# EasyEDA schematic LEDA_Arcade Controller Touch sensor.json
TITLE: SliderPiece; REV: 1.0; Date: 2019-05-25; Sheet: 1/1; Drawn By: nobody; Company: Personal
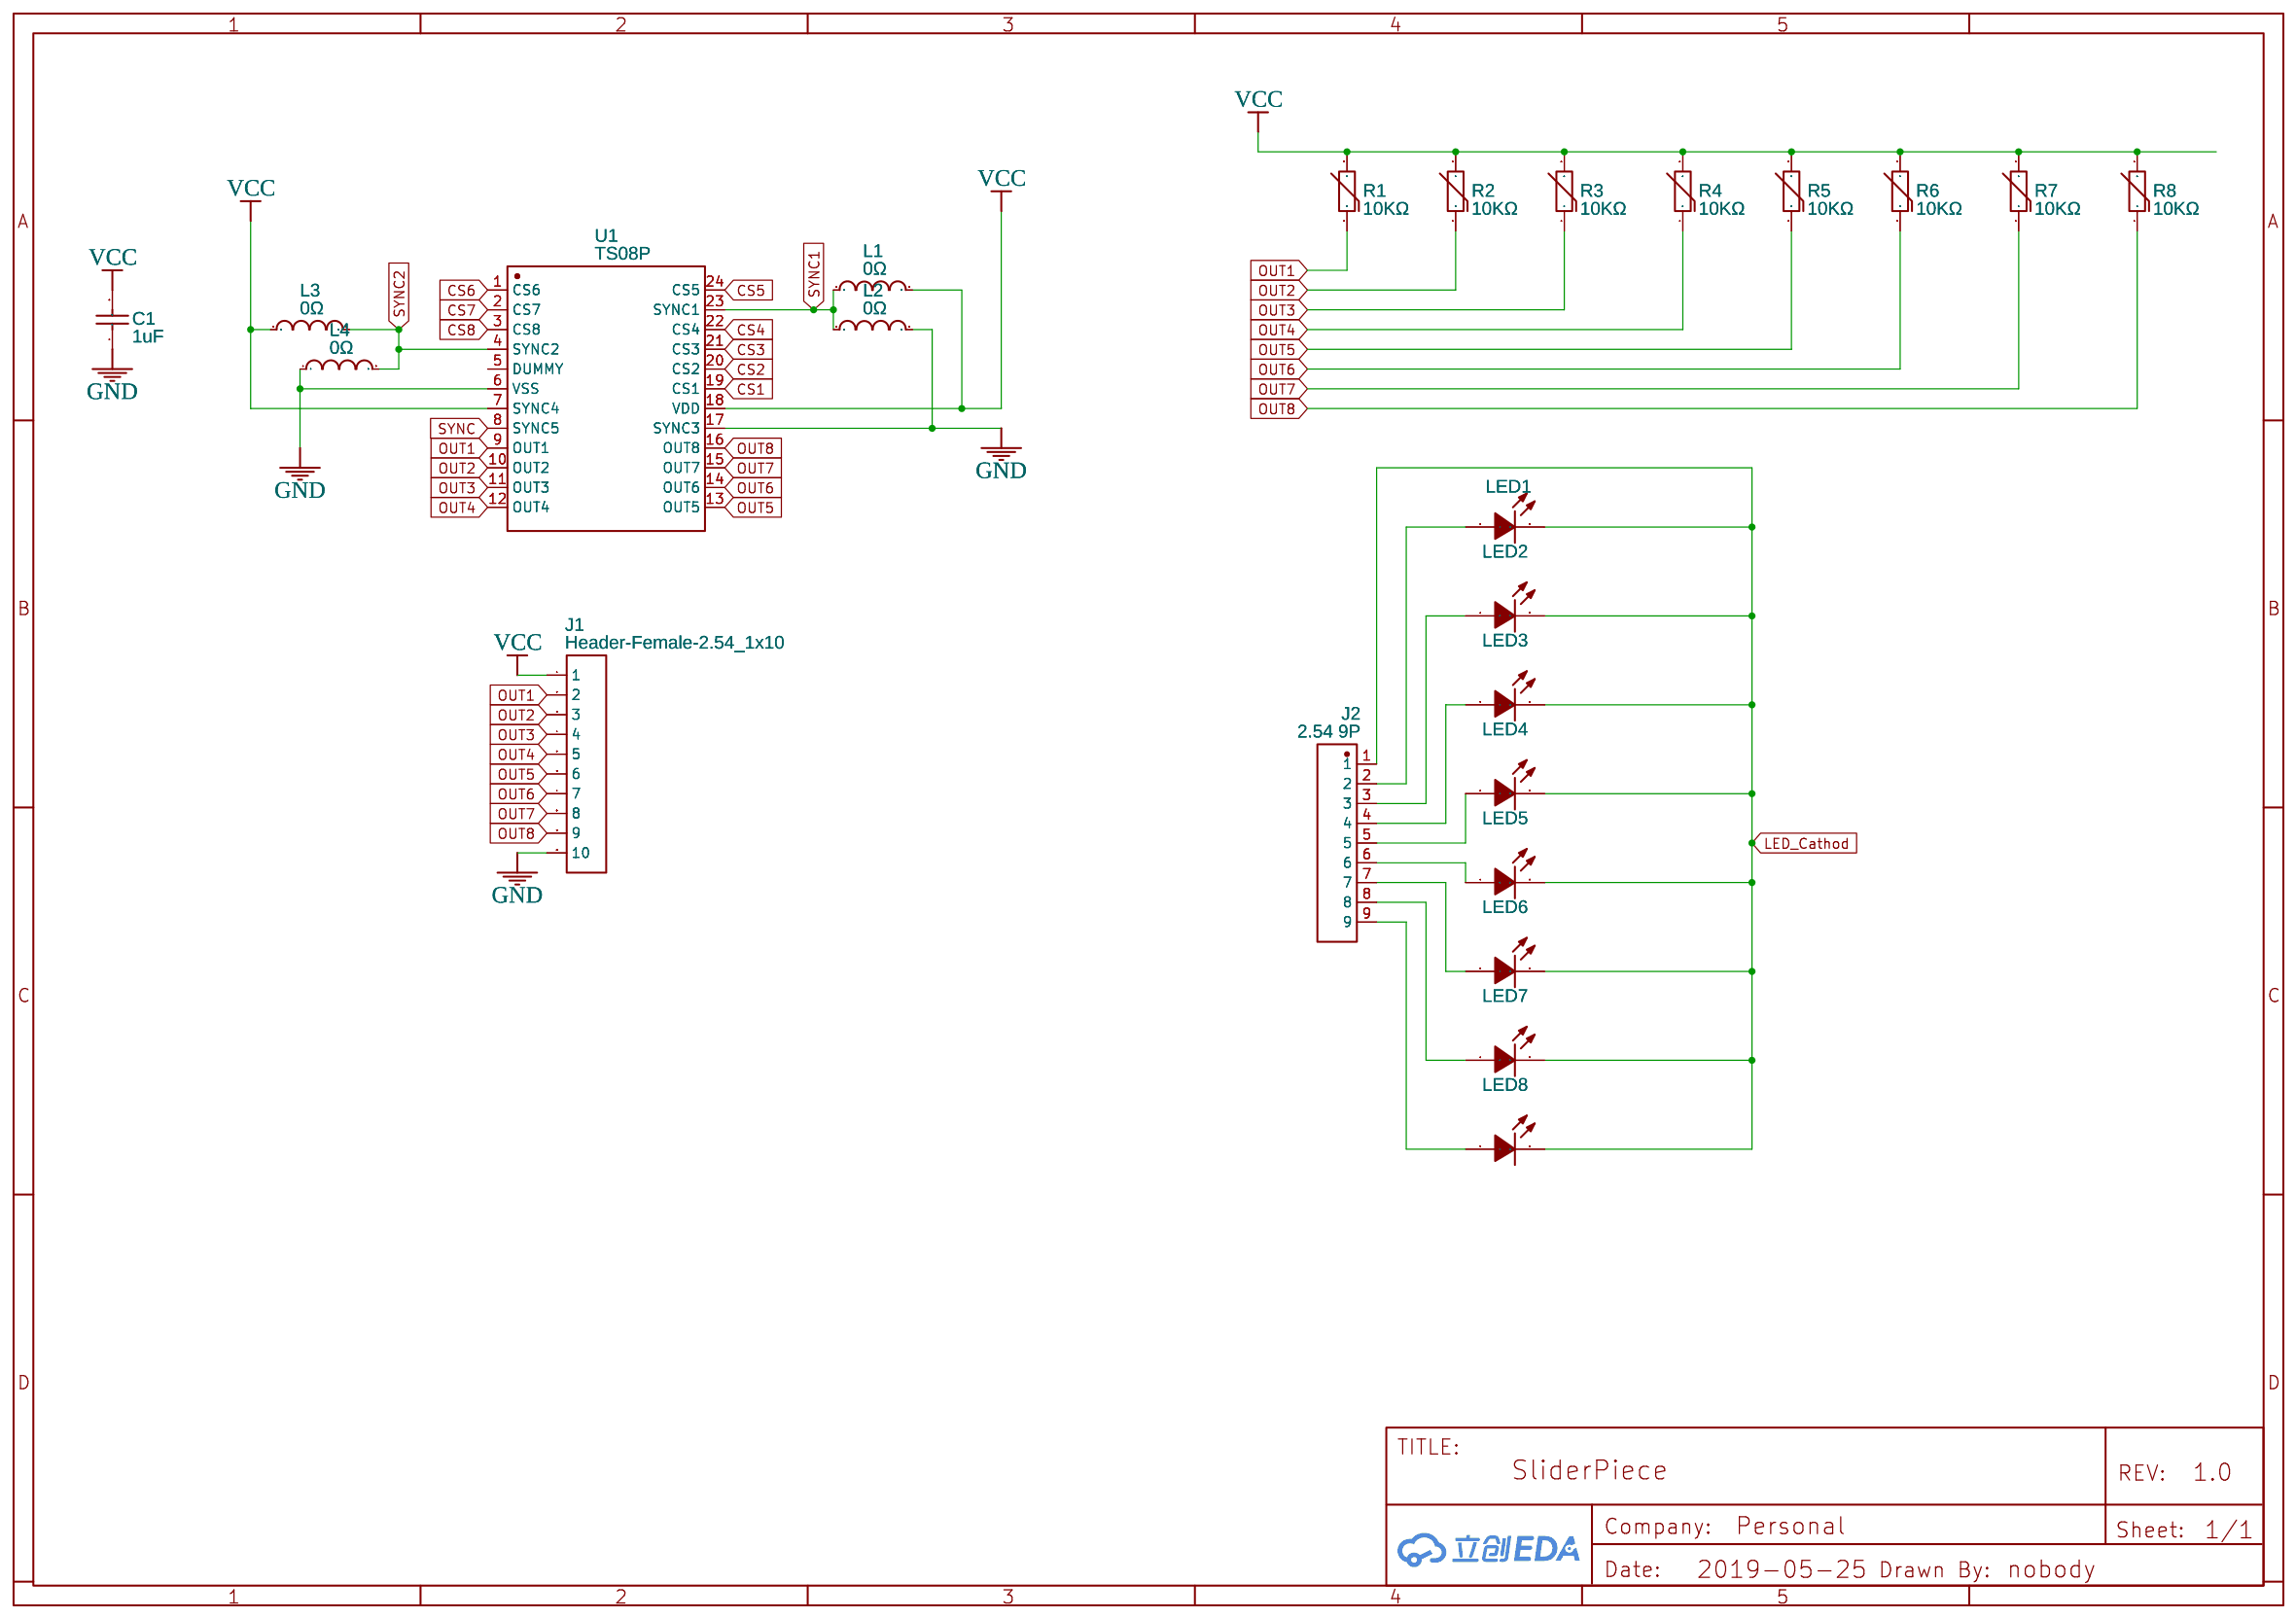
[diagram p0: schematic sheet]

## Parts
C1  1uF  [0603]
J1  Header-Female-2.54_1x10  [HDR-TH_10PIN-V-FEMALE-PITCH2.54]
J2  2.54 9P  [1X9_2.54MM_PTH]
L1  0Ω  [0603]
L2  0Ω  [0603]
L3  0Ω  [0603]
L4  0Ω  [0603]
LED1  333-2SUGC/S400-A5  [LED-5MM]
LED2  333-2SUGC/S400-A5  [LED-5MM]
LED3  333-2SUGC/S400-A5  [LED-5MM]
LED4  333-2SUGC/S400-A5  [LED-5MM]
LED5  333-2SUGC/S400-A5  [LED-5MM]
LED6  333-2SUGC/S400-A5  [LED-5MM]
LED7  333-2SUGC/S400-A5  [LED-5MM]
LED8  333-2SUGC/S400-A5  [LED-5MM]
R1  10KΩ  [0603]
R2  10KΩ  [0603]
R3  10KΩ  [0603]
R4  10KΩ  [0603]
R5  10KΩ  [0603]
R6  10KΩ  [0603]
R7  10KΩ  [0603]
R8  10KΩ  [0603]
U1  TS08P  [QSOP-24_150MIL]

## Library data of the parts
C1 = UMK107AB7105KA-T: Supplier: LCSC; Manufacturer: TAIYO YUDEN; Contributor: LCSC; Supplier Part: C105174
J1 = -: Supplier: LCSC; Manufacturer: BOOMELE; Manufacturer Part: 2.54mm 1*10P Straight Female header Gold-plated; Supplier Part: C35445
J2 = -: Manufacturer Part: ?; Contributor: 6B732F50
L1-L4 = CBG160808U000T: Supplier: LCSC; Manufacturer: FH; Supplier Part: C43163; LCSC Assembly: Yes; SMT Type: Extend
LED1-LED8 = -: Supplier: LCSC; Manufacturer: EVERLIGHT; Contributor: LCSC; Supplier Part: C125761
R1-R8 = CMFA103J35000HANT: Supplier: LCSC; Manufacturer: FH; Supplier Part: C107464
U1 = -: Supplier: LCSC; Manufacturer: AD Semicon; Contributor: LCSC; Supplier Part: C132388

## Nets
GND: C1.1 J1.10 L2.2 L4.1 U1.6(VSS) U1.17(SYNC3)
VCC: C1.2 J1.1 L1.2 L3.1 R1.2 R2.2 R3.2 R4.2 R5.2 R6.2 R7.2 R8.2 U1.7(SYNC4) U1.18(VDD)
CS1: U1.19(CS1)
CS2: U1.20(CS2)
CS3: U1.21(CS3)
CS4: U1.22(CS4)
CS5: U1.24(CS5)
CS6: U1.1(CS6)
CS7: U1.2(CS7)
CS8: U1.3(CS8)
LED_Cathod: J2.1 LED1.2(K) LED2.2(K) LED3.2(K) LED4.2(K) LED5.2(K) LED6.2(K) LED7.2(K) LED8.2(K)
OUT1: J1.2 R1.1 U1.9(OUT1)
OUT2: J1.3 R2.1 U1.10(OUT2)
OUT3: J1.4 R3.1 U1.11(OUT3)
OUT4: J1.5 R4.1 U1.12(OUT4)
OUT5: J1.6 R5.1 U1.13(OUT5)
OUT6: J1.7 R6.1 U1.14(OUT6)
OUT7: J1.8 R7.1 U1.15(OUT7)
OUT8: J1.9 R8.1 U1.16(OUT8)
SYNC: U1.8(SYNC5)
SYNC1: L1.1 L2.1 U1.23(SYNC1)
SYNC2: L3.2 L4.2 U1.4(SYNC2)
Net-(J2-2): J2.2 LED1.1(A)
Net-(J2-3): J2.3 LED2.1(A)
Net-(J2-4): J2.4 LED3.1(A)
Net-(J2-5): J2.5 LED4.1(A)
Net-(J2-6): J2.6 LED5.1(A)
Net-(J2-7): J2.7 LED6.1(A)
Net-(J2-8): J2.8 LED7.1(A)
Net-(J2-9): J2.9 LED8.1(A)

Not connected (* = marked no-connect by the designer): U1 5(DUMMY)
